# EAGLE design Kit Main (EAGLE 4.16)
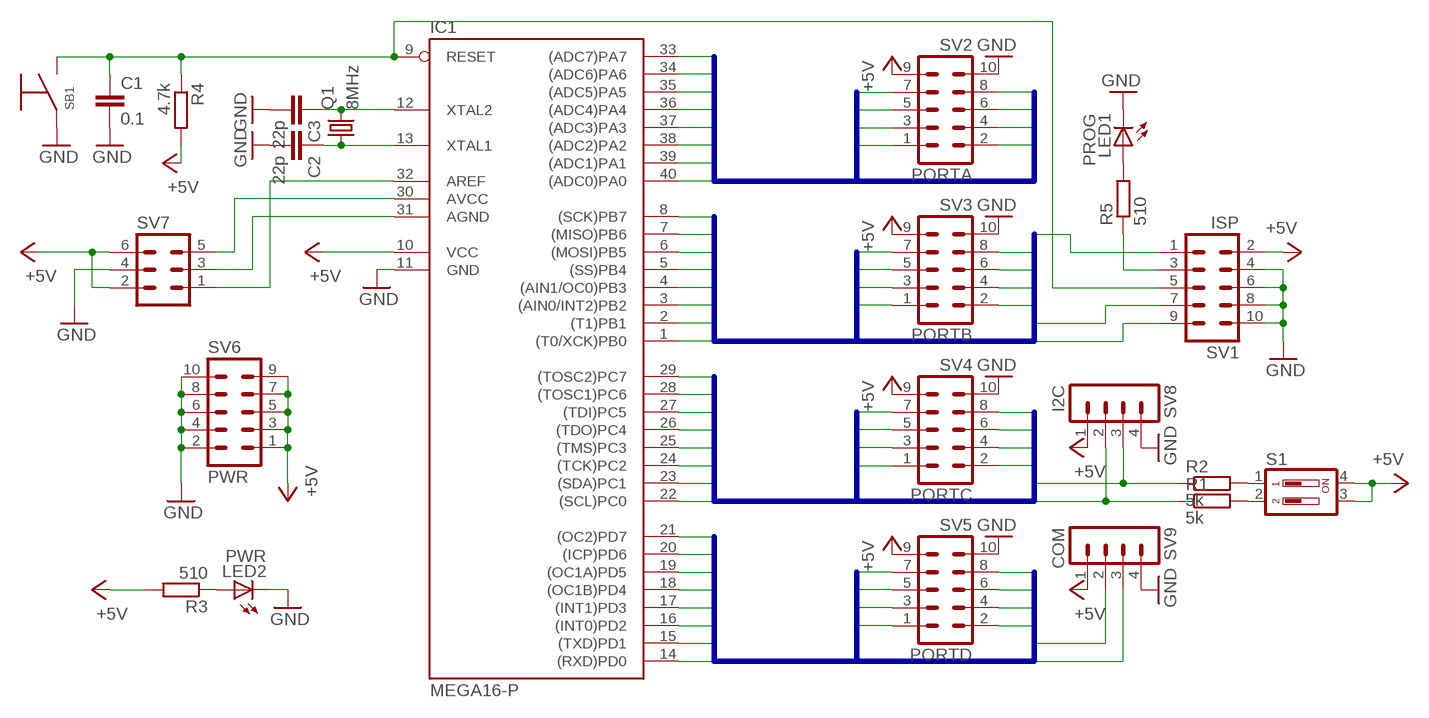
[diagram p0: schematic, sheet 1]

## Parts
C1  0.1  C-EUC0805  [C0805]
C2  22p  C-EUC0805  [C0805]
C3  22p  C-EUC0805  [C0805]
IC1  MEGA16-P  [DIL40]
LED1  PROG  LED3MM  [LED3MM]
LED2  PWR  LED3MM  [LED3MM]
Q1  8MHz  CRYSTALHC49S  [HC49/S]
R1  5k  R-EU_M0805  [M0805]
R2  5k  R-EU_M0805  [M0805]
R3  510  R-EU_M0805  [M0805]
R4  4.7k  R-EU_M0805  [M0805]
R5  510  R-EU_M0805  [M0805]
S1  DS02  [DS-02]
SB1  RESET  BUTTON_6X3MM  [BUTTON_6X3MM]
SV1  ISP  MA05-2  [MA05-2]
SV2  PORTA  MA05-2  [MA05-2]
SV3  PORTB  MA05-2  [MA05-2]
SV4  PORTC  MA05-2  [MA05-2]
SV5  PORTD  MA05-2  [MA05-2]
SV6  PWR  MA05-2  [MA05-2]
SV7  MA03-2  [MA03-2]
SV8  I2C  MA04-1  [MA04-1]
SV9  COM  MA04-1  [MA04-1]

## Nets
+5V: IC1.10(VCC) R3.2 R4.2 S1.3 S1.4 SV1.2 SV2.9 SV3.9 SV4.9 SV5.9 SV6.1 SV6.3 SV6.5 SV6.7 SV6.9 SV7.2 SV7.6 SV8.1 SV9.1
GND: C1.2 C2.2 C3.2 IC1.11(GND) LED1.K(C) LED2.K(C) SB1.P$2 SV1.4 SV1.6 SV1.8 SV1.10 SV2.10 SV3.10 SV4.10 SV5.10 SV6.2 SV6.4 SV6.6 SV6.8 SV6.10 SV7.4 SV8.4 SV9.4
N$1: C3.1 IC1.12(XTAL2) Q1.2
N$2: C2.1 IC1.13(XTAL1) Q1.1
N$3: R1.2 S1.2
N$4: R2.2 S1.1
N$5: LED2.A R3.1
N$6: IC1.32(AREF) SV7.1
N$7: IC1.30(AVCC) SV7.5
N$8: IC1.31(AGND) SV7.3
N$9: LED1.A R5.2
N$10: R5.1 SV1.3
PA0: IC1.40((ADC0)PA0) SV2.1
PA1: IC1.39((ADC1)PA1) SV2.2
PA2: IC1.38((ADC2)PA2) SV2.3
PA3: IC1.37((ADC3)PA3) SV2.4
PA4: IC1.36((ADC4)PA4) SV2.5
PA5: IC1.35((ADC5)PA5) SV2.6
PA6: IC1.34((ADC6)PA6) SV2.7
PA7: IC1.33((ADC7)PA7) SV2.8
PB0: IC1.1((T0/XCK)PB0) SV3.1
PB1: IC1.2((T1)PB1) SV3.2
PB2: IC1.3((AIN0/INT2)PB2) SV3.3
PB3: IC1.4((AIN1/OC0)PB3) SV3.4
PB4: IC1.5((SS)PB4) SV3.5
PB5: IC1.6((MOSI)PB5) SV1.1 SV3.6
PB6: IC1.7((MISO)PB6) SV1.9 SV3.7
PB7: IC1.8((SCK)PB7) SV1.7 SV3.8
PC0: IC1.22((SCL)PC0) R2.1 SV4.1 SV8.3
PC1: IC1.23((SDA)PC1) R1.1 SV4.2 SV8.2
PC2: IC1.24((TCK)PC2) SV4.3
PC3: IC1.25((TMS)PC3) SV4.4
PC4: IC1.26((TDO)PC4) SV4.5
PC5: IC1.27((TDI)PC5) SV4.6
PC6: IC1.28((TOSC1)PC6) SV4.7
PC7: IC1.29((TOSC2)PC7) SV4.8
PD0: IC1.14((RXD)PD0) SV5.1 SV9.2
PD1: IC1.15((TXD)PD1) SV5.2 SV9.3
PD2: IC1.16((INT0)PD2) SV5.3
PD3: IC1.17((INT1)PD3) SV5.4
PD4: IC1.18((OC1B)PD4) SV5.5
PD5: IC1.19((OC1A)PD5) SV5.6
PD6: IC1.20((ICP)PD6) SV5.7
PD7: IC1.21((OC2)PD7) SV5.8
RESET: C1.1 IC1.9(RESET) R4.1 SB1.P$3 SV1.5

## Buses
PA:PA[0..7]
PB:PB[0..7]
PC:PC[0..7]
PD:PD[0..7]

## Library data of the parts
C1-C3 = rcl:C-EU: CAPACITOR, European symbol
IC1 = atmel:MEGA16-P: MICROCONTROLLER 16 Kbytes FLASH 1 kbytes SRAM 512 bytes EEPROM USART 8-channel 10 bit ADC Source: avr.lbr
LED1 LED2 = led:LED: LED OSRAM: - CHIPLED LG R971, LG N971, LY N971, LG Q971, LY Q971, LO R971, LY R971 LH N974, LH R974 LS Q976, LO Q976, LY Q976 LO Q996 - Hyper CHIPLED LW Q18S LB Q993, LB Q99A, LB R99A - SideLED LS A670, LO A670, LY A670, LG A670, LP A670 LB A673, LV A673, LT A673, LW A673 LH A674 LY A675 LS A676, LA A676, LO A676, LY A676, LW A676 LS A679, LY A679, LG A679 - Hyper Micro SIDELED® LS Y876, LA Y876, LO Y876, LY Y876 LT Y87S - SmartLED LW L88C, LW L88S LB L89C, LB L89S, LG L890 LS L89K, LO L89K, LY L89K LS L896, LA L896, LO L896, LY L896 - TOPLED LS T670, LO T670, LY T670, LG T670, LP T670 LSG T670, LSP T670, LSY T670, LOP T670, LYG T670 LG T671, LOG T671, LSG T671 LB T673, LV T673, LT T673, LW T673 LH T674 LS T676, LA T676, LO T676, LY T676, LB T676, LH T676, LSB T676, LW T676 LB T67C, LV T67C, LT T67C, LS T67K, LO T67K, LY T67K, LW E67C LS E67B, LA E67B, LO E67B, LY E67B, LB E67C, LV E67C, LT E67C LW T67C LS T679, LY T679, LG T679 LS T770, LO T770, LY T770, LG T770, LP T770 LB T773, LV T773, LT T773, LW T773 LH T774 LS E675, LA E675, LY E675, LS T675 LS T776, LA T776, LO T776, LY T776, LB T776 LHGB T686 LT T68C, LB T68C - Hyper Mini TOPLED® LB M676 - Mini TOPLED Santana® LG M470 LS M47K, LO M47K, LY M47K Source: http://www.osram.convergy.de - LUMILED® LXK2-PW12-R00, LXK2-PW12-S00, LXK2-PW14-U00, LXK2-PW14-V00 LXK2-PM12-R00, LXK2-PM12-S00, LXK2-PM14-U00 LXK2-PE12-Q00, LXK2-PE12-R00, LXK2-PE12-S00, LXK2-PE14-T00, LXK2-PE14-U00 LXK2-PB12-K00, LXK2-PB12-L00, LXK2-PB12-M00, LXK2-PB14-N00, LXK2-PB14-P00, LXK2-PB14-Q00 LXK2-PR12-L00, LXK2-PR12-M00, LXK2-PR14-Q00, LXK2-PR14-R00 LXK2-PD12-Q00, LXK2-PD12-R00, LXK2-PD12-S00 LXK2-PH12-R00, LXK2-PH12-S00 LXK2-PL12-P00, LXK2-PL12-Q00, LXK2-PL12-R00 Source: www.luxeon.com
Q1 = crystal:CRYSTAL: CRYSTAL
R1-R5 = rcl:R-EU_: RESISTOR, European symbol
S1 = switch-dil:DS02: DIL/CODE SWITCH
SB1 = sw+but:BUTTON_6X3MM
SV1-SV6 = con-lstb:MA05-2: PIN HEADER
SV7 = con-lstb:MA03-2: PIN HEADER
SV8 SV9 = con-lstb:MA04-1: PIN HEADER

## Board
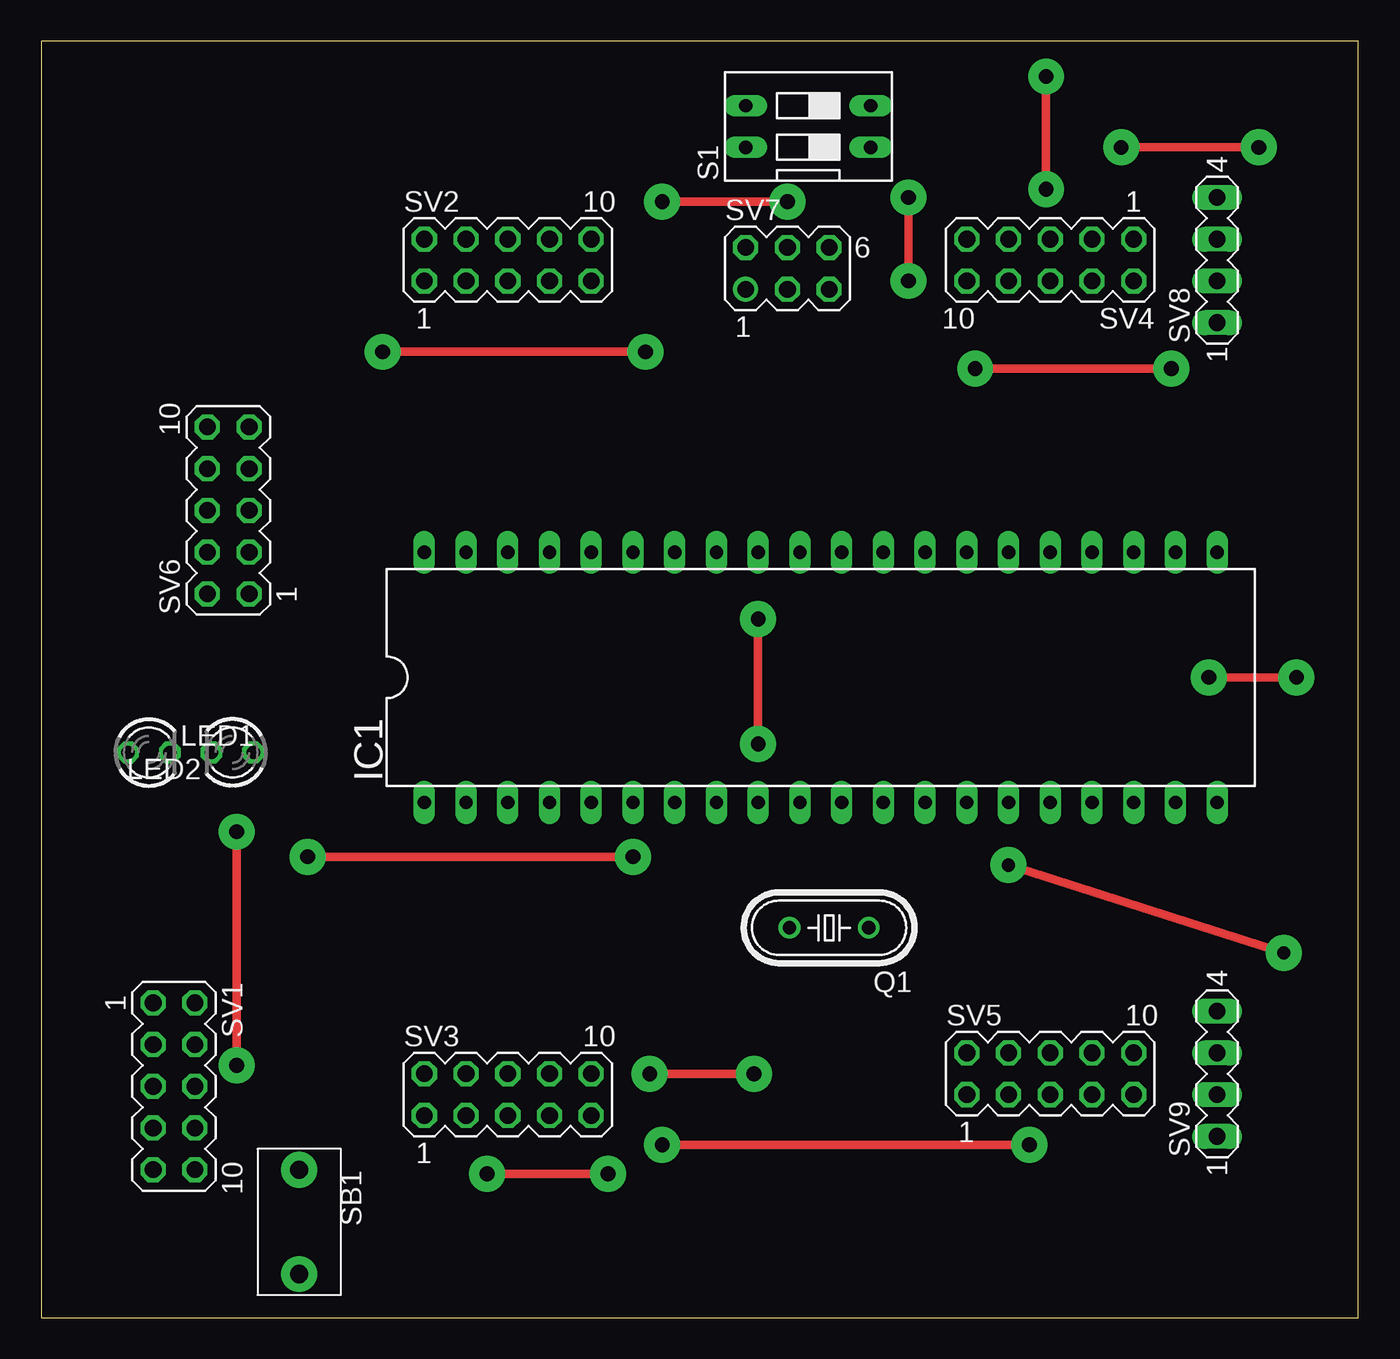
[diagram p1: board, top side]
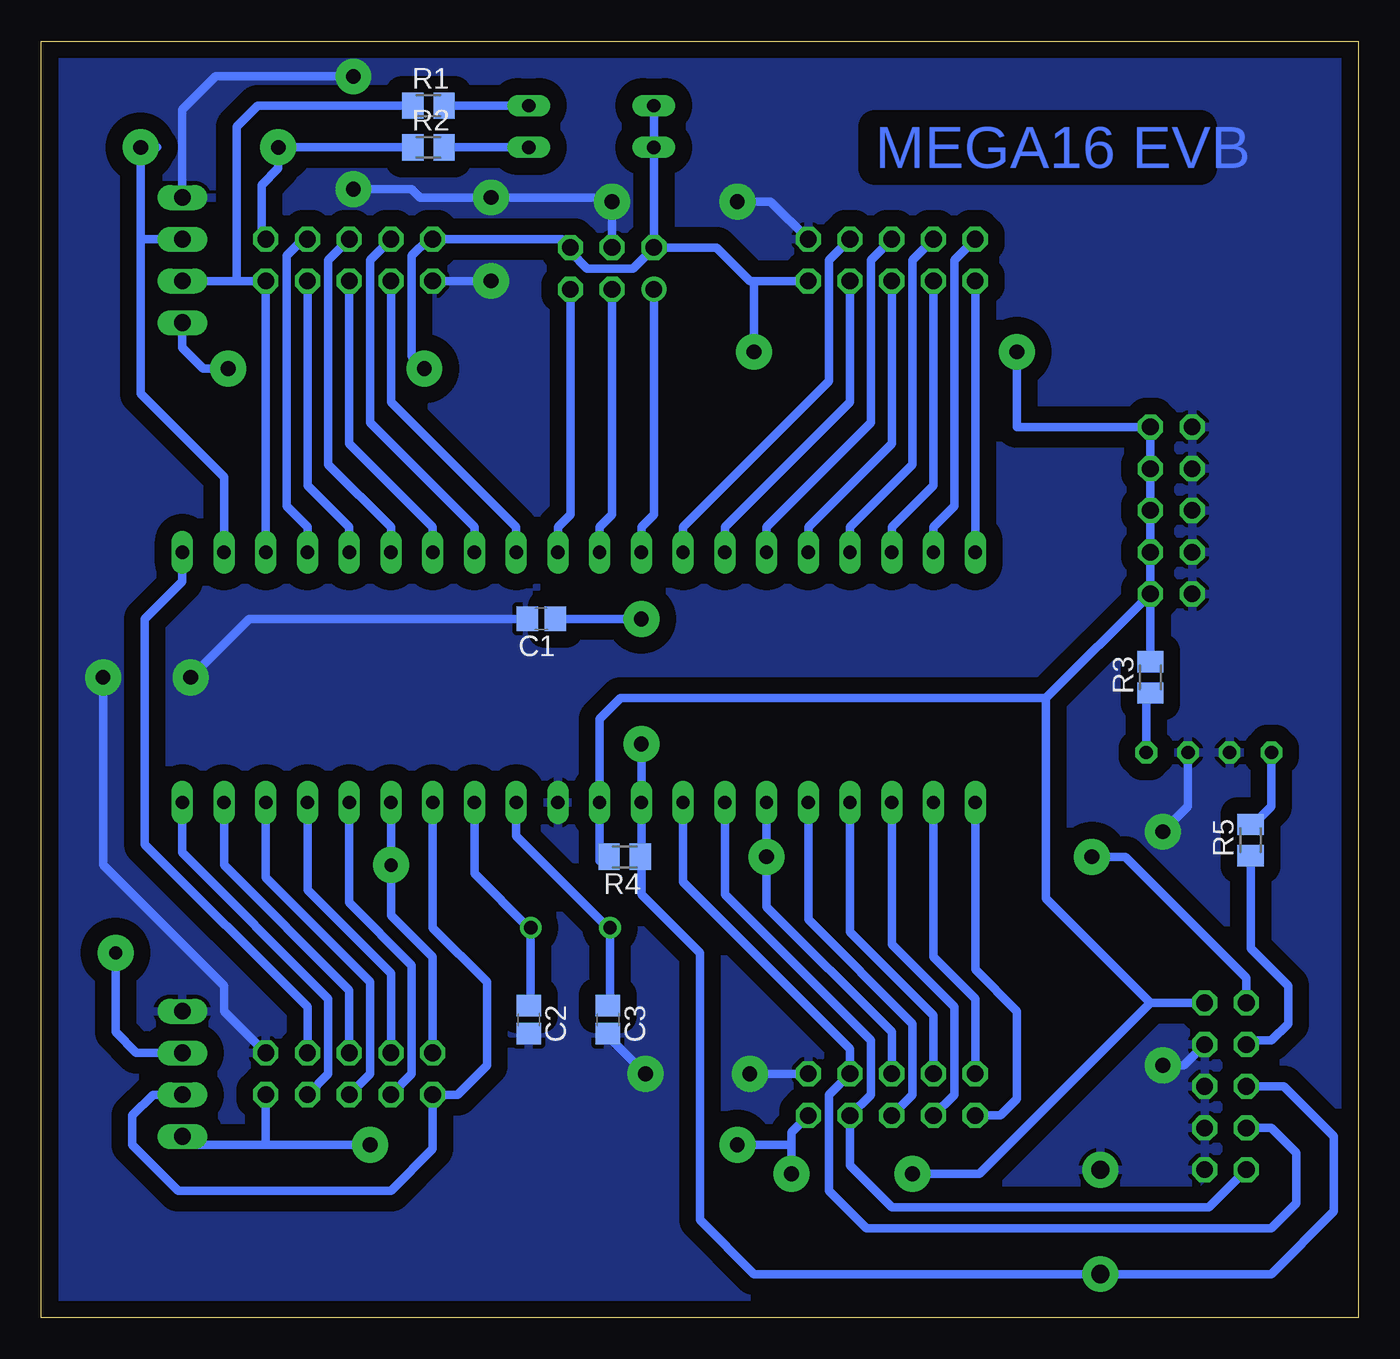
[diagram p2: board, bottom side, seen from below]

Size 80.19 x 77.71 mm. Coordinates in mm from the lower left corner, seen from the top.
Outline: 0,0 80.19,0 80.19,77.71 0,77.71 0,0
Copper layers (1*16): Top 0.035mm / dielectric 1.5mm / Bottom 0.035mm
Design rules "dimka": minimum track width 10mil, minimum drill 24mil, track to track 10mil, track to pad 10mil, pad to pad 10mil, via to via 10mil, smd to smd 10mil, copper to edge 40mil, drill to drill 10mil, minimum pad ring 10mil, minimum via ring 8mil, stop-mask expansion 4mil, vias tented up to drill 0mil, thermal gap 10mil

### Footprints (pad centres in the part's own frame; a part is rotated, then mirrored left to right if it is on the bottom)
C0805 = smd 1.3 x 1.5: 1 -0.85,0; 2 0.85,0
DIL40 = drill 0.813 long: 1 -24.13,-7.62; 2 -21.59,-7.62; 3 -19.05,-7.62; 4 -16.51,-7.62; 5 -13.97,-7.62; 6 -11.43,-7.62; 7 -8.89,-7.62; 8 -6.35,-7.62; 9 -3.81,-7.62; 10 -1.27,-7.62; 11 1.27,-7.62; 12 3.81,-7.62; 13 6.35,-7.62; 14 8.89,-7.62; 15 11.43,-7.62; 16 13.97,-7.62; 17 16.51,-7.62; 18 19.05,-7.62; 19 21.59,-7.62; 20 24.13,-7.62; 21 24.13,7.62; 22 21.59,7.62; 23 19.05,7.62; 24 16.51,7.62; 25 13.97,7.62; 26 11.43,7.62; 27 8.89,7.62; 28 6.35,7.62; 29 3.81,7.62; 30 1.27,7.62; 31 -1.27,7.62; 32 -3.81,7.62; 33 -6.35,7.62; 34 -8.89,7.62; 35 -11.43,7.62; 36 -13.97,7.62; 37 -16.51,7.62; 38 -19.05,7.62; 39 -21.59,7.62; 40 -24.13,7.62
LED3MM = drill 0.813 octagon: A -1.27,0; K 1.27,0
HC49/S = drill 0.813 round: 1 -2.413,0; 2 2.413,0
M0805 = smd 1.3 x 1.6: 1 -0.95,0; 2 0.95,0
DS-02 = drill 0.813 long: 1 -1.27,-3.81; 2 1.27,-3.81; 3 1.27,3.81; 4 -1.27,3.81
BUTTON_6X3MM = drill 1.1 pad 2.184 round: P$2 0,0; P$3 6.35,0
MA05-2 = drill 1.016 octagon: 1 -5.08,-1.27; 2 -5.08,1.27; 3 -2.54,-1.27; 4 -2.54,1.27; 5 0,-1.27; 6 0,1.27; 7 2.54,-1.27; 8 2.54,1.27; 9 5.08,-1.27; 10 5.08,1.27
MA03-2 = drill 1.016 round: 1 -2.54,-1.27 | drill 1.016 octagon: 2 -2.54,1.27; 3 0,-1.27; 4 0,1.27; 5 2.54,-1.27; 6 2.54,1.27
MA04-1 = drill 1.016 long: 1 -3.81,0; 2 -1.27,0; 3 1.27,0; 4 3.81,0

### Placement (x,y rotation side)
C1  49.75,42.54 180 bottom
C2  50.51,18.16 270 bottom
C3  45.68,18.16 270 bottom
IC1  47.46,38.98 0 top
LED1  6.57,34.41 0 top
LED2  11.65,34.41 180 top
Q1  47.97,23.74 180 top
R1  56.6,73.78 0 bottom
R2  56.6,71.24 0 bottom
R3  12.66,38.98 90 bottom
R4  44.67,28.06 180 bottom
R5  6.57,29.08 90 bottom
S1  46.7,72.51 90 top
SB1  15.71,9.01 270 top
SV1  8.09,14.09 270 top
SV2  28.41,64.38 0 top
SV3  28.41,13.58 0 top
SV4  61.43,64.38 180 top
SV5  61.43,14.85 0 top
SV6  11.39,49.14 90 top
SV7  45.43,63.88 0 top
SV8  71.59,64.38 90 top
SV9  71.59,14.85 90 top

### Tracks (layer width: path | path; a pad name or v marks a point on that pad's centre or on a via)
+5V  (via drill 0.9 pad 2.18)
  Top 0.508: v56.86,57.78 v68.8,57.78 | v27.14,8.76 v34.51,8.76 | v37.81,10.54 v60.16,10.54 | v20.79,58.8 v36.79,58.8
  Bottom 0.508: 54.57,65.65 SV4.9 | SV7.2 44.16,63.88 46.95,63.88 47.97,64.89 SV7.6 48.48,65.65 54.57,65.65 | v68.8,57.78 70.32,57.78 71.59,59.05 SV8.1 | S1.3 S1.4 SV7.2 | 36.79,63.11 SV2.9 | 36.79,63.11 37.05,63.11 39.08,65.15 SV7.2 | R4.2 45.94,28.06 46.19,27.81 IC1.10 46.19,36.44 44.92,37.71 19.01,37.71 | SV1.2 12.66,19.17 | 12.66,19.17 19.01,25.52 19.01,37.71 | SV6.1 SV6.3 | SV6.3 SV6.5 SV6.7 SV6.9 | SV3.9 34.51,11.3 34.51,10.54 | v34.51,8.76 34.51,10.54 | v27.14,8.76 23.08,8.76 12.66,19.17 | 34.51,10.54 v37.81,10.54 | SV9.1 71.08,10.54 66.51,10.54 | v60.16,10.54 66.51,10.54 | 66.51,10.54 SV5.9 | SV6.3 SV6.9 | v20.79,58.8 20.79,54.22 SV6.9 | v36.79,58.8 36.79,63.11 | SV6.1 R3.2 | SV6.1 SV6.3 | 19.01,37.71 SV6.1 | 54.57,65.65 56.6,65.65 57.62,64.64 57.62,58.54 v56.86,57.78
GND  (via drill 0.9 pad 2.18)
  Top 0.508: v37.05,14.85 v43.4,14.85 | v76.42,38.98 v71.08,38.98 | v52.79,68.19 v52.79,63.11 | v37.81,67.94 v45.43,67.94 | v61.18,68.7 v61.18,75.56 | v11.9,15.36 v11.9,29.59
  Bottom 0.508: C2.2 50.34,17.14 | SV3.10 v37.05,14.85 | 45.68,17.39 C3.2 45.68,17.14 v43.4,14.85 | SV5.10 69.05,18.66 69.05,20.19 76.42,27.55 v76.42,38.98 | v71.08,38.98 67.53,42.54 51.02,42.54 50.76,42.79 50.6,42.63 C1.2 | v52.79,63.11 SV4.10 | v45.43,67.94 SV7.4 45.43,67.18 46.44,68.19 v52.79,68.19 57.11,68.19 57.62,68.7 v61.18,68.7 | v37.81,67.94 35.78,67.94 SV2.10 | SV8.4 71.59,73.53 69.56,75.56 v61.18,75.56 | LED2.K 10.38,31.11 v11.9,29.59 | v11.9,15.36 10.63,15.36 SV1.4
  pour Bottom (isolate 1.016): 0.72,77.59 79.21,77.59 79.21,0.63 0.72,0.63
N$1
  Bottom 0.508: IC1.12 51.27,29.33 45.68,23.74 Q1.2 45.56,19.05 45.68,18.92 C3.1
N$2
  Bottom 0.508: IC1.13 53.81,27.05 50.51,23.74 Q1.1 50.38,19.05 50.34,19.01 | 50.34,19.01 50.25,18.92 | C2.1 50.34,19.01
N$3
  Bottom 0.508: S1.2 R1.2
N$4
  Bottom 0.508: S1.1 R2.2
N$5
  Bottom 0.508: R3.1 12.92,38.03 LED2.A
N$6
  Bottom 0.508: SV7.1 42.89,48.89 43.65,48.13 IC1.32
N$7
  Bottom 0.508: SV7.5 47.97,48.89 48.73,48.13 IC1.30
N$8
  Bottom 0.508: SV7.3 45.43,48.89 46.19,48.13 IC1.31
N$9
  Bottom 0.508: LED1.A 5.3,31.11 6.57,29.84 R5.2
N$10
  Bottom 0.508: SV1.3 6.57,16.89 5.3,16.89 4.28,17.9 4.28,20.19 6.57,22.47 R5.1
PA0
  Bottom 0.508: IC1.40 SV2.1
PA1
  Bottom 0.508: SV2.2 24.6,64.38 24.6,49.4 25.87,48.13 IC1.39
PA2
  Bottom 0.508: SV2.3 25.87,50.67 28.41,48.13 IC1.38
PA3
  Bottom 0.508: SV2.4 27.14,64.38 27.14,51.94 30.95,48.13 IC1.37
PA4
  Bottom 0.508: SV2.5 28.41,53.21 33.49,48.13 IC1.36
PA5
  Bottom 0.508: SV2.6 29.68,64.38 29.68,54.48 36.03,48.13 IC1.35
PA6
  Bottom 0.508: SV2.7 30.95,55.75 38.57,48.13 IC1.34
PA7
  Bottom 0.508: SV2.8 32.22,64.38 32.22,57.02 41.11,48.13 IC1.33
PB0
  Bottom 0.508: SV3.1 21.81,12.31 20.79,13.33 20.79,18.66 23.33,21.2 IC1.1
PB1
  Bottom 0.508: IC1.2 25.87,21.97 23.33,19.43 SV3.2
PB2
  Bottom 0.508: SV3.3 24.6,13.58 24.6,18.92 28.41,22.73 IC1.3
PB3
  Bottom 0.508: IC1.4 30.95,23.49 25.87,18.41 SV3.4
PB4
  Bottom 0.508: SV3.5 27.14,13.58 27.14,17.9 33.49,24.25 IC1.5
PB5  (via drill 0.9 pad 2.18)
  Top 0.508: v16.22,28.06 v36.03,28.06
  Bottom 0.508: IC1.6 v36.03,28.06 36.03,25.01 28.41,17.39 SV3.6 | SV1.1 6.82,20.7 14.19,28.06 v16.22,28.06
PB6
  Bottom 0.508: IC1.7 38.57,25.78 29.68,16.89 29.68,13.58 SV3.7 30.95,9.27 28.41,6.73 9.11,6.73 SV1.9
PB7
  Bottom 0.508: IC1.8 41.11,26.54 30.95,16.38 SV3.8 32.22,13.58 32.22,7.74 29.93,5.46 5.3,5.46 3.77,6.98 3.77,10.03 5.3,11.55 SV1.7
PC0  (via drill 0.9 pad 2.18)
  Top 0.508: v74.13,71.24 v65.75,71.24
  Bottom 0.508: R2.1 v65.75,71.24 65.75,69.97 66.76,68.96 66.76,65.91 SV4.1 | IC1.22 69.05,51.18 74.13,56.26 74.13,64.64 | 74.13,64.64 74.13,64.89 | 74.13,64.64 74.13,65.65 | 73.11,71.24 v74.13,71.24 74.13,65.65 | 74.13,65.65 SV8.3
PC1
  Bottom 0.508: IC1.23 SV4.2 68.29,63.11 | 68.29,63.11 SV8.2 | 68.29,63.11 68.29,72.51 67.02,73.78 R1.1
PC2
  Bottom 0.508: SV4.3 64.22,65.65 65.24,64.64 65.24,49.4 63.97,48.13 IC1.24
PC3
  Bottom 0.508: SV4.4 63.97,50.67 61.43,48.13 IC1.25
PC4
  Bottom 0.508: SV4.5 62.7,64.38 62.7,51.94 58.89,48.13 IC1.26
PC5
  Bottom 0.508: SV4.6 61.43,53.21 56.35,48.13 IC1.27
PC6
  Bottom 0.508: SV4.7 60.16,64.38 60.16,54.48 53.81,48.13 IC1.28
PC7
  Bottom 0.508: SV4.8 58.89,55.75 51.27,48.13 IC1.29
PD0
  Bottom 0.508: IC1.14 56.35,23.74 53.05,20.44 53.05,15.36 54.83,13.58 SV5.1 56.35,10.28 58.89,7.74 71.84,7.74 74.64,10.54 74.64,12.31 73.37,13.58 SV9.2
PD1  (via drill 0.8 pad 2.18)
  Top 0.508: v58.89,27.55 v75.65,22.22
  Bottom 0.508: IC1.15 v58.89,27.55 58.89,24.51 56.35,21.97 SV5.2 | SV9.3 74.38,16.12 75.65,17.39 v75.65,22.22
PD2
  Bottom 0.508: IC1.16 61.43,25.27 57.62,21.46 57.62,14.85 SV5.3
PD3
  Bottom 0.508: IC1.17 63.97,26.03 58.89,20.95 SV5.4
PD4
  Bottom 0.508: IC1.18 66.51,26.79 60.16,20.44 60.16,14.85 SV5.5
PD5
  Bottom 0.508: IC1.19 69.05,27.55 61.43,19.93 SV5.6
PD6
  Bottom 0.508: IC1.20 71.59,28.32 62.7,19.43 62.7,14.85 SV5.7
PD7
  Bottom 0.508: IC1.21 71.59,44.83 73.88,42.54 73.88,28.82 63.97,18.92 SV5.8
RESET  (via drill 0.9 pad 2.18)
  Top 0.508: v43.65,34.92 v43.65,42.54
  Bottom 0.508: 43.65,28.06 R4.1 | 43.65,28.06 IC1.9 v43.65,34.92 | SV1.5 4.53,14.09 1.49,11.04 1.49,6.47 5.3,2.66 SB1.P$3 15.71,2.41 15.96,2.66 36.79,2.66 40.09,5.96 40.09,22.22 43.65,25.78 43.65,28.06 | v43.65,42.54 C1.1

### Text on the board
Bottom: MEGA16 EVB